# EAGLE design droidbot_main_HW (EAGLE 7.3.0)
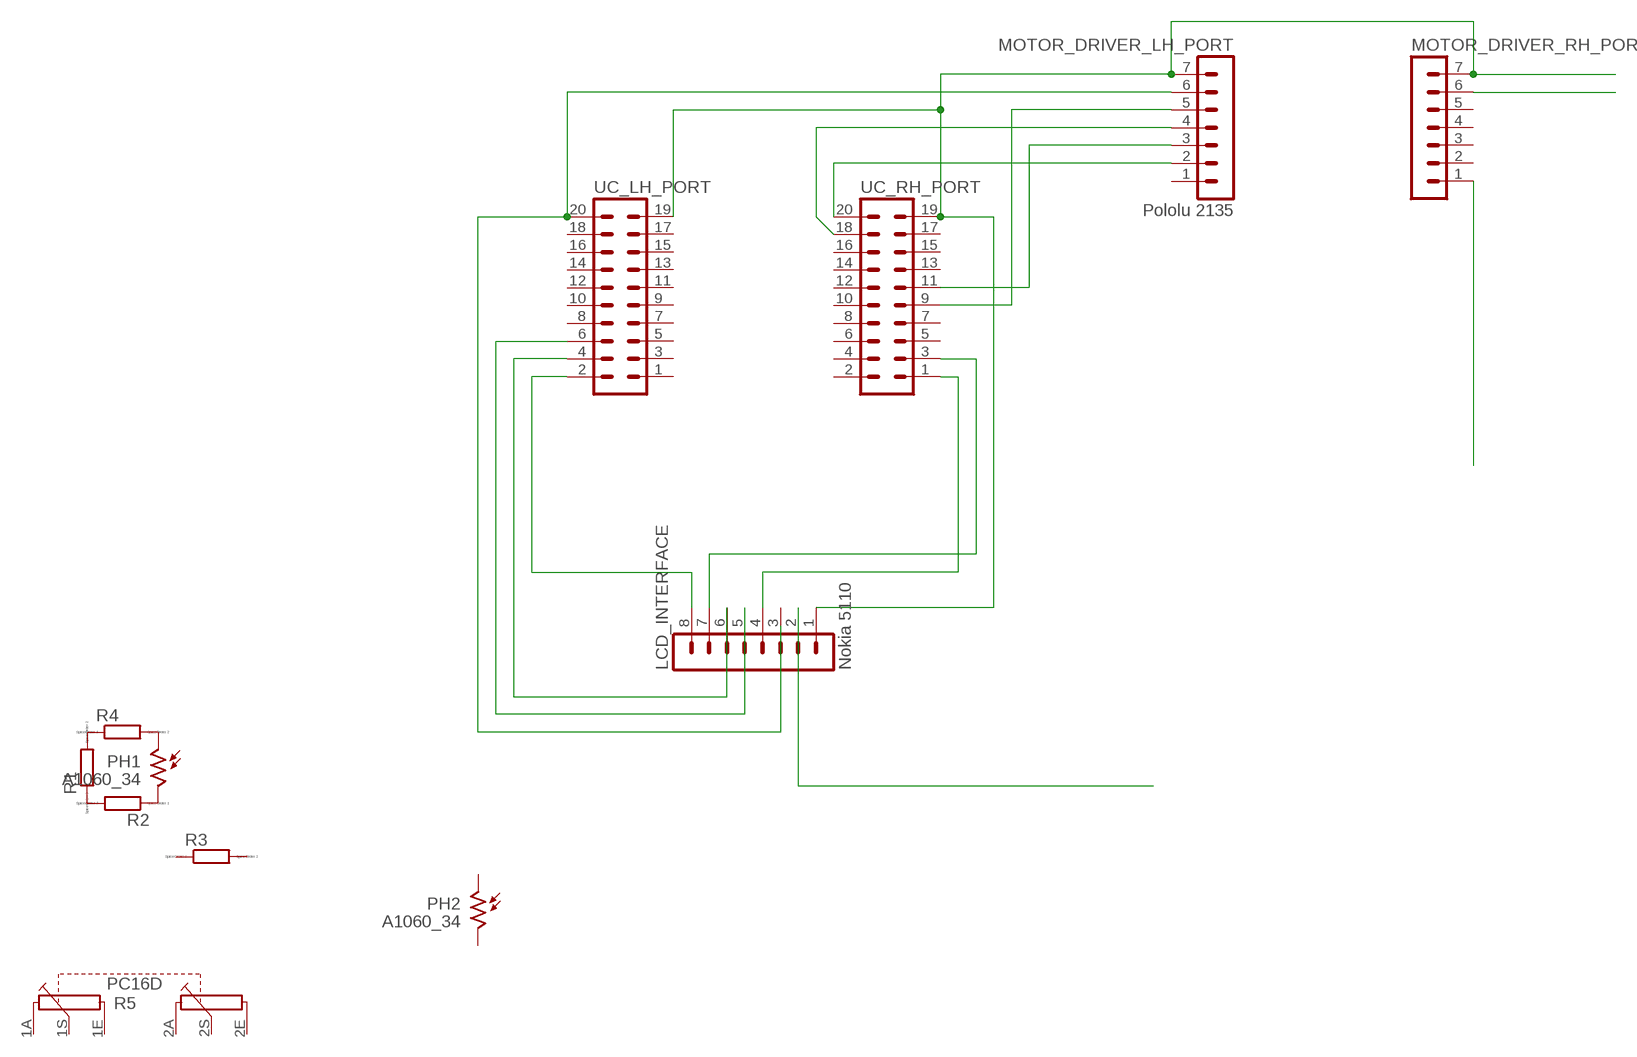
[diagram p0: schematic, sheet 1]

## Parts
LCD_INTERFACE  Nokia 5110  MA08-1  [MA08-1]
MOTOR_DRIVER_LH_PORT  Pololu 2135  MA07-1  [MA07-1]
MOTOR_DRIVER_RH_PORT  MA07-1  [MA07-1]
PH1  A1060_34  [T0-46-A10XX]
PH2  A1060_34  [T0-46-A10XX]
R1  R0204/7  [0204/7]
R2  R0204/7  [0204/7]
R3  R0204/7  [0204/7]
R4  R0204/7  [0204/7]
R5  PC16D  [PC16D]
UC_LH_PORT  MA10-2  [MA10-2]
UC_RH_PORT  MA10-2  [MA10-2]

## Nets
N$1: LCD_INTERFACE.8 UC_LH_PORT.2
N$2: LCD_INTERFACE.7 UC_RH_PORT.3
N$3: LCD_INTERFACE.6 UC_LH_PORT.4
N$4: LCD_INTERFACE.5 UC_LH_PORT.6
N$5: LCD_INTERFACE.4 UC_RH_PORT.1
N$6: MOTOR_DRIVER_LH_PORT.5 UC_RH_PORT.9
N$7: LCD_INTERFACE.2
N$8: MOTOR_DRIVER_LH_PORT.6 UC_LH_PORT.20
N$9: LCD_INTERFACE.1 MOTOR_DRIVER_LH_PORT.7 MOTOR_DRIVER_RH_PORT.7 UC_LH_PORT.19 UC_RH_PORT.19
N$10: MOTOR_DRIVER_LH_PORT.4 UC_RH_PORT.18
N$11: MOTOR_DRIVER_LH_PORT.2 UC_RH_PORT.20
N$12: MOTOR_DRIVER_LH_PORT.3 UC_RH_PORT.11
N$13: MOTOR_DRIVER_RH_PORT.6
N$14: MOTOR_DRIVER_RH_PORT.1
N$15: R1.1 R2.2
N$16: R1.2 R4.1
N$17: PH1.2 R2.1
N$18: PH1.1 R4.2
Unconnected: LCD_INTERFACE.3 MOTOR_DRIVER_LH_PORT.1 MOTOR_DRIVER_RH_PORT.2 MOTOR_DRIVER_RH_PORT.3 MOTOR_DRIVER_RH_PORT.4 MOTOR_DRIVER_RH_PORT.5 PH2.1 PH2.2 R3.1 R3.2 R5.1A R5.1E R5.1S R5.2A R5.2E R5.2S UC_LH_PORT.1 UC_LH_PORT.3 UC_LH_PORT.5 UC_LH_PORT.7 UC_LH_PORT.8 UC_LH_PORT.9 UC_LH_PORT.10 UC_LH_PORT.11 UC_LH_PORT.12 UC_LH_PORT.13 UC_LH_PORT.14 UC_LH_PORT.15 UC_LH_PORT.16 UC_LH_PORT.17 UC_LH_PORT.18 UC_RH_PORT.2 UC_RH_PORT.4 UC_RH_PORT.5 UC_RH_PORT.6 UC_RH_PORT.7 UC_RH_PORT.8 UC_RH_PORT.10 UC_RH_PORT.12 UC_RH_PORT.13 UC_RH_PORT.14 UC_RH_PORT.15 UC_RH_PORT.16 UC_RH_PORT.17

## Notes on the sheet
- Tiva C Series
  TM4C123G

## Library data of the parts
LCD_INTERFACE = con-lstb:MA08-1: PIN HEADER; OC_FARNELL: unknown; OC_NEWARK: unknown
MOTOR_DRIVER_LH_PORT MOTOR_DRIVER_RH_PORT = con-lstb:MA07-1: PIN HEADER; OC_FARNELL: unknown; OC_NEWARK: unknown
PH1 PH2 = photo-elements:A10: Sensor Robust Light Sensing Applications Outdoor Light Sensing Application Source: http://optoelectronics.perkinelmer.com/content/Datasheets/DTS_PhotocellsA1050.pdf
R1-R4 = eagle-ltspice:R: RESISTOR, European symbol; SPICEMODEL: NONE; SPICEPREFIX: R
R5 = piher:PC16D: POTENTIOMETER tandem carbon potentiometer, 16 mm, S3ROH; OC_FARNELL: 4453049; OC_NEWARK: unknown
UC_LH_PORT UC_RH_PORT = con-lstb:MA10-2: PIN HEADER; OC_FARNELL: unknown; OC_NEWARK: unknown

## Board
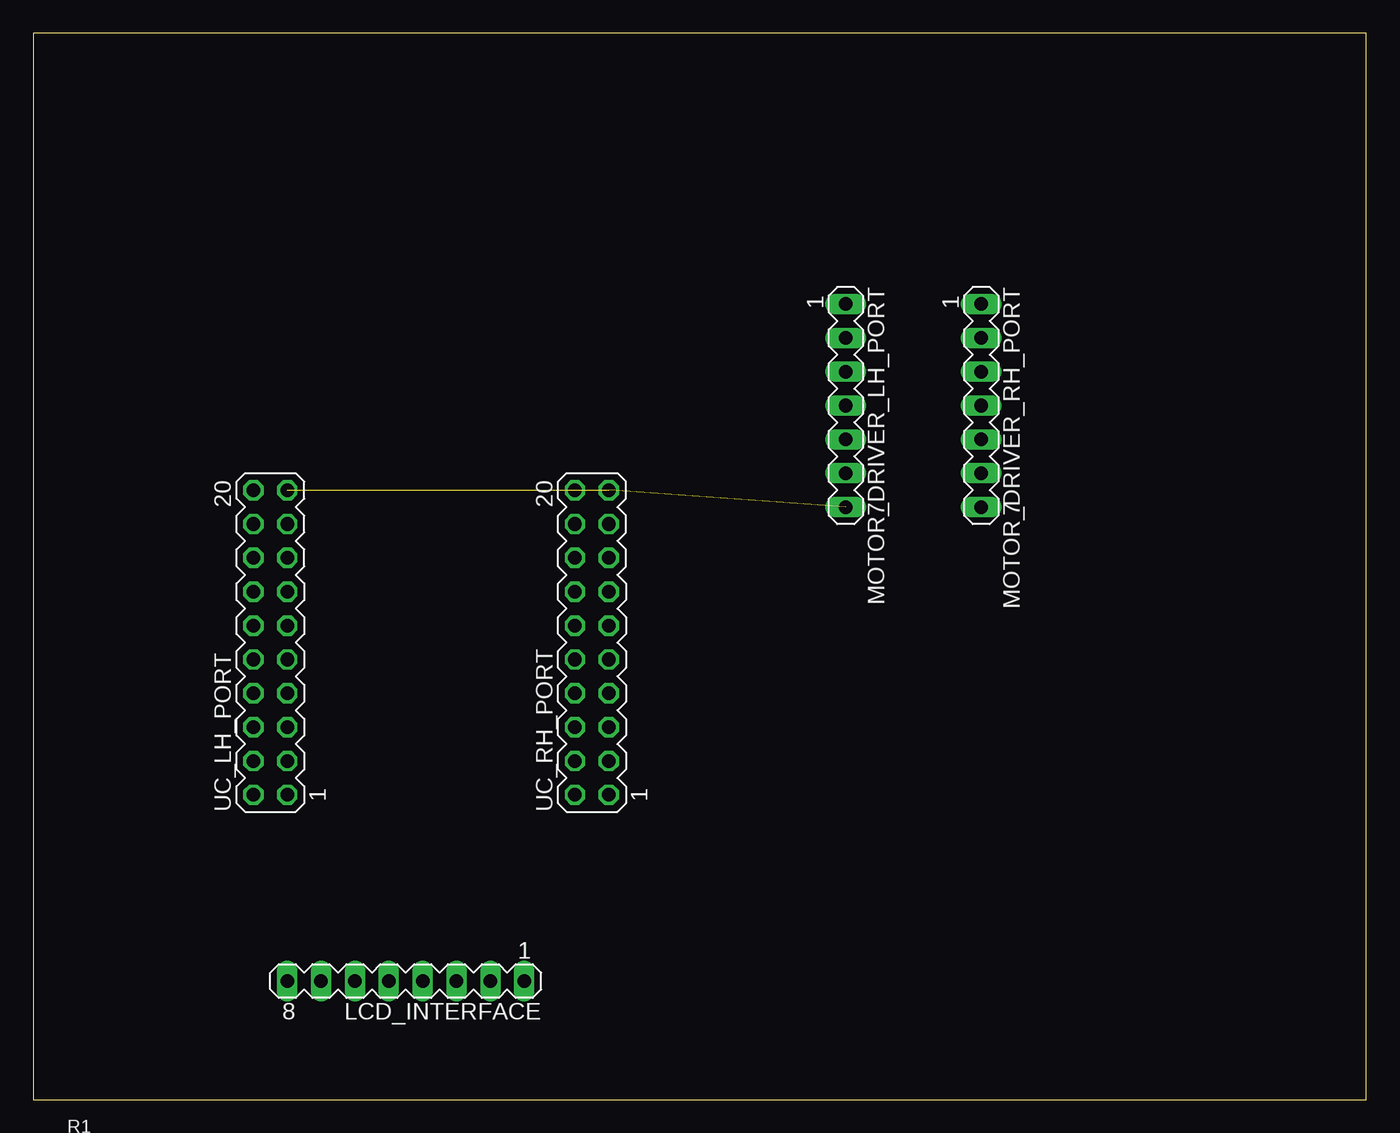
[diagram p1: board, top side]
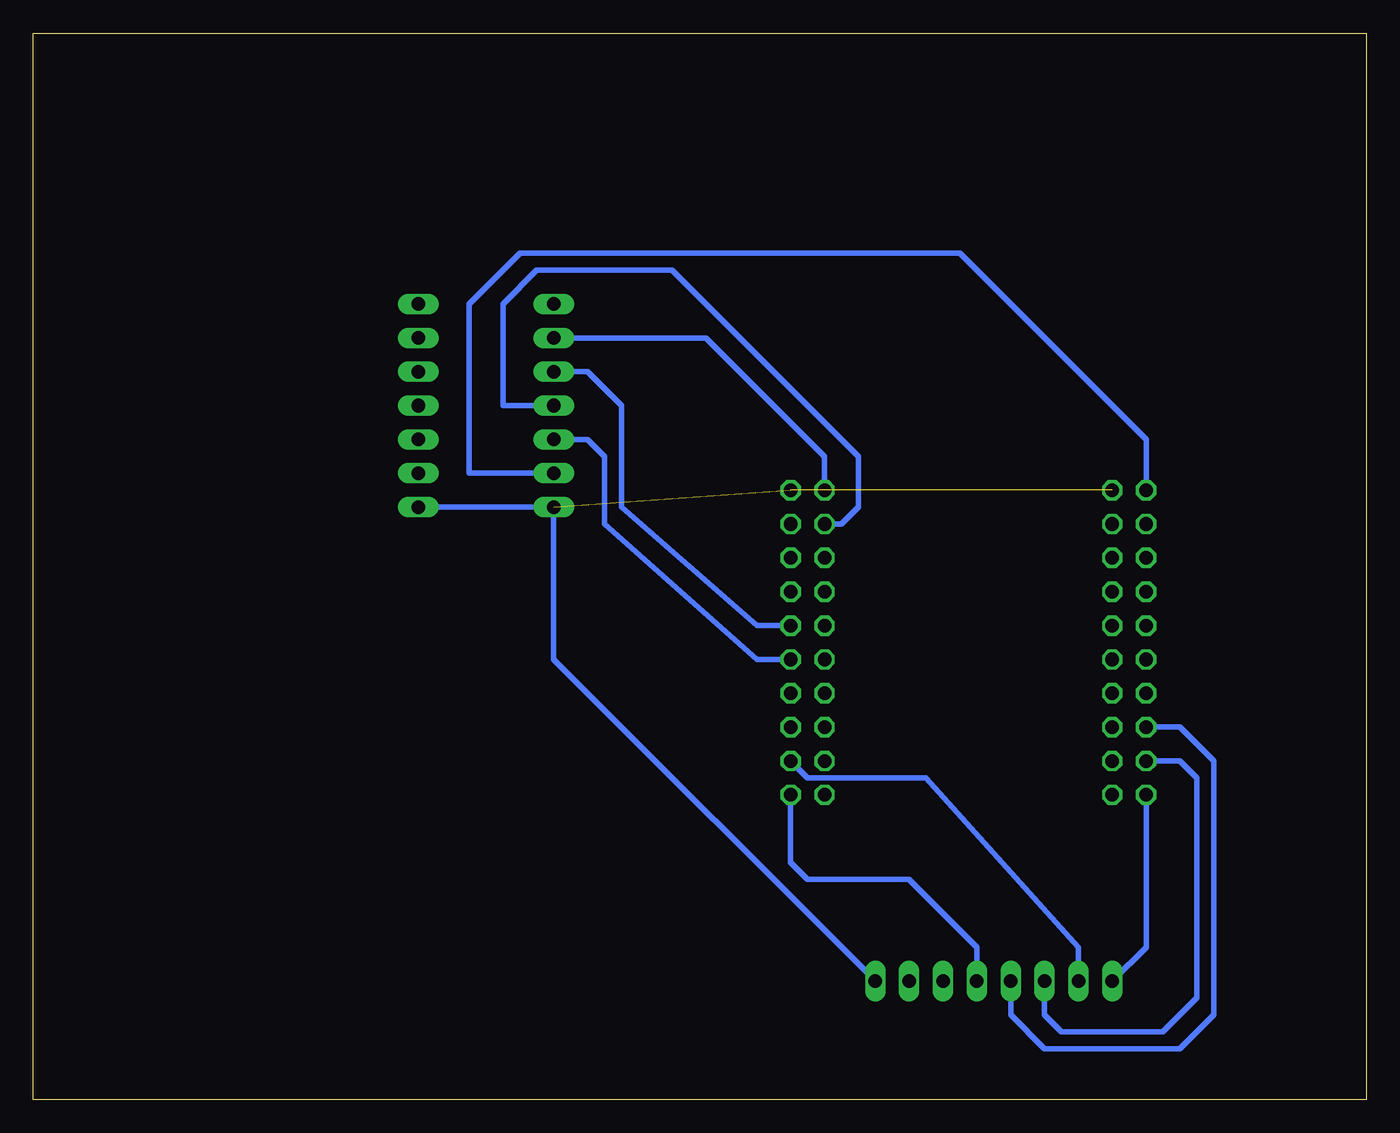
[diagram p2: board, bottom side, seen from below]

Size 100 x 80 mm. Coordinates in mm from the lower left corner, seen from the top.
Outline: 0,0 100,0 100,80 0,80 0,0
Copper layers (1*16): Top 0.035mm / dielectric 1.5mm / Bottom 0.035mm
Design rules "default": minimum track width 10mil, minimum drill 24mil, track to track 8mil, track to pad 8mil, pad to pad 8mil, via to via 8mil, smd to smd 8mil, copper to edge 40mil, drill to drill 8mil, minimum pad ring 10mil, minimum via ring 8mil, stop-mask expansion 4mil, vias tented up to drill 0mil, thermal gap 10mil

### Footprints (pad centres in the part's own frame; a part is rotated, then mirrored left to right if it is on the bottom)
MA08-1 = drill 1.016 long: 1 -8.89,0; 2 -6.35,0; 3 -3.81,0; 4 -1.27,0; 5 1.27,0; 6 3.81,0; 7 6.35,0; 8 8.89,0
MA07-1 = drill 1.016 long: 1 -7.62,0; 2 -5.08,0; 3 -2.54,0; 4 0,0; 5 2.54,0; 6 5.08,0; 7 7.62,0
T0-46-A10XX = drill 0.7 pad 1.4: 1 -1.7,0; 2 1.7,0
0204/7 = drill 0.813 octagon: 1 -3.81,0; 2 3.81,0
PC16D = drill 1.2 long: 1A -5,6.5; 1E 5,6.5; 1S 0,6.5; 2A -5,14; 2E 5,14; 2S 0,14
MA10-2 = drill 1.016 octagon: 1 -11.43,-1.27; 2 -11.43,1.27; 3 -8.89,-1.27; 4 -8.89,1.27; 5 -6.35,-1.27; 6 -6.35,1.27; 7 -3.81,-1.27; 8 -3.81,1.27; 9 -1.27,-1.27; 10 -1.27,1.27; 11 1.27,-1.27; 12 1.27,1.27; 13 3.81,-1.27; 14 3.81,1.27; 15 6.35,-1.27; 16 6.35,1.27; 17 8.89,-1.27; 18 8.89,1.27; 19 11.43,-1.27; 20 11.43,1.27

### Placement (x,y rotation side)
LCD_INTERFACE  27.94,8.89 180 top
MOTOR_DRIVER_LH_PORT  60.96,52.07 270 top
MOTOR_DRIVER_RH_PORT  71.12,52.07 270 top
PH1  -6.35,-10.16 0 top  (outside the outline)
PH2  -15.24,-10.16 0 top  (outside the outline)
R1  5.08,-3.81 0 top  (outside the outline)
R2  5.08,-7.62 0 top  (outside the outline)
R3  5.08,-11.43 0 top  (outside the outline)
R4  5.08,-15.24 0 top  (outside the outline)
R5  -29.21,29.21 0 top  (outside the outline)
UC_LH_PORT  17.78,34.29 90 top
UC_RH_PORT  41.91,34.29 90 top

### Tracks (layer width: path | path; a pad name or v marks a point on that pad's centre or on a via)
N$1
  Bottom 0.406: LCD_INTERFACE.8 16.51,11.43 UC_LH_PORT.2
N$2
  Bottom 0.406: LCD_INTERFACE.7 21.59,11.43 33.02,24.13 41.91,24.13 UC_RH_PORT.3
N$3
  Bottom 0.406: UC_LH_PORT.4 13.97,25.4 12.7,24.13 12.7,7.62 15.24,5.08 22.86,5.08 24.13,6.35 LCD_INTERFACE.6
N$4
  Bottom 0.406: LCD_INTERFACE.5 26.67,6.35 24.13,3.81 13.97,3.81 11.43,6.35 11.43,25.4 13.97,27.94 UC_LH_PORT.6
N$5
  Bottom 0.406: UC_RH_PORT.1 43.18,17.78 41.91,16.51 34.29,16.51 29.21,11.43 LCD_INTERFACE.4
N$6
  Bottom 0.406: MOTOR_DRIVER_LH_PORT.5 58.42,49.53 57.15,48.26 57.15,43.18 45.72,33.02 UC_RH_PORT.9
N$8
  Bottom 0.406: UC_LH_PORT.20 16.51,49.53 30.48,63.5 63.5,63.5 67.31,59.69 67.31,46.99 MOTOR_DRIVER_LH_PORT.6
N$9  (2 unrouted)
  Bottom 0.406: MOTOR_DRIVER_RH_PORT.7 MOTOR_DRIVER_LH_PORT.7 60.96,33.02 LCD_INTERFACE.1
N$10
  Bottom 0.406: UC_RH_PORT.18 39.37,43.18 38.1,44.45 38.1,48.26 52.07,62.23 62.23,62.23 64.77,59.69 64.77,52.07 MOTOR_DRIVER_LH_PORT.4
N$11
  Bottom 0.406: UC_RH_PORT.20 40.64,48.26 49.53,57.15 MOTOR_DRIVER_LH_PORT.2
N$12
  Bottom 0.406: UC_RH_PORT.11 45.72,35.56 55.88,44.45 55.88,52.07 58.42,54.61 MOTOR_DRIVER_LH_PORT.3
N$15  (1 unrouted)
N$16  (1 unrouted)
N$17  (1 unrouted)
N$18  (1 unrouted)